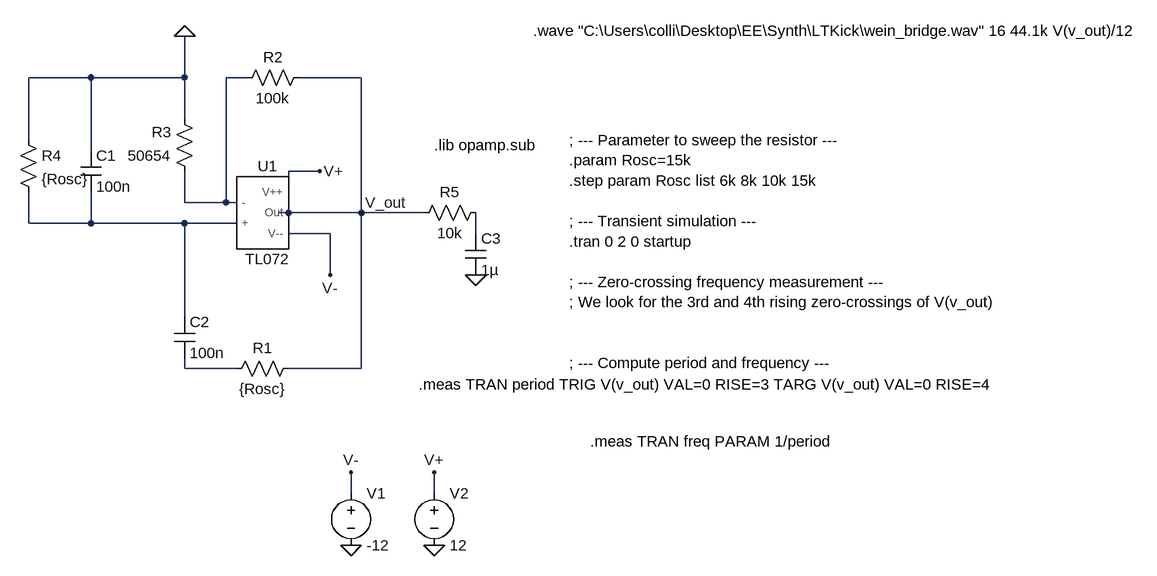
[diagram p0: schematic WeinBridgeV1.asc]
WeinBridgeV1.asc, the LTspice schematic file:
Version 4
SHEET 1 1672 728
WIRE -64 -64 -160 -64
WIRE 80 -64 80 -128
WIRE 80 -64 -64 -64
WIRE 176 -64 144 -64
WIRE 352 -64 256 -64
WIRE 80 0 80 -64
WIRE -160 32 -160 -64
WIRE -64 48 -64 -64
WIRE 288 80 240 80
WIRE 240 112 240 80
WIRE 80 128 80 80
WIRE 144 128 144 -64
WIRE 144 128 80 128
WIRE 160 128 144 128
WIRE 240 144 224 144
WIRE 352 144 352 -64
WIRE 352 144 240 144
WIRE 448 144 352 144
WIRE -160 160 -160 112
WIRE -64 160 -64 112
WIRE -64 160 -160 160
WIRE 80 160 -64 160
WIRE 160 160 80 160
WIRE 304 176 240 176
WIRE 528 176 528 144
WIRE 304 240 304 176
WIRE 80 304 80 160
WIRE 80 384 80 368
WIRE 160 384 80 384
WIRE 352 384 352 144
WIRE 352 384 240 384
WIRE 336 576 336 544
WIRE 464 576 464 544
FLAG 80 -128 0
FLAG 352 144 V_out
FLAG 336 656 0
FLAG 464 656 0
FLAG 464 544 V+
FLAG 336 544 V-
FLAG 288 80 V+
FLAG 304 240 V-
FLAG 528 240 0
SYMBOL res 256 368 R90
WINDOW 0 0 56 VBottom 2
WINDOW 3 32 56 VTop 2
SYMATTR InstName R1
SYMATTR Value {Rosc}
SYMBOL res 272 -80 R90
WINDOW 0 0 56 VBottom 2
WINDOW 3 32 56 VTop 2
SYMATTR InstName R2
SYMATTR Value 100k
SYMBOL res 96 96 R180
WINDOW 0 36 76 Left 2
WINDOW 3 36 40 Left 2
SYMATTR InstName R3
SYMATTR Value 50654
SYMBOL res -176 16 R0
SYMATTR InstName R4
SYMATTR Value {Rosc}
SYMBOL cap -80 48 R0
SYMATTR InstName C1
SYMATTR Value 100n
SYMBOL cap 64 304 R0
SYMATTR InstName C2
SYMATTR Value 100n
SYMBOL voltage 336 560 R0
WINDOW 123 0 0 Left 0
WINDOW 39 0 0 Left 0
SYMATTR InstName V1
SYMATTR Value -12
SYMBOL voltage 464 560 R0
WINDOW 123 0 0 Left 0
WINDOW 39 0 0 Left 0
SYMATTR InstName V2
SYMATTR Value 12
SYMBOL res 544 128 R90
WINDOW 0 0 56 VBottom 2
WINDOW 3 32 56 VTop 2
SYMATTR InstName R5
SYMATTR Value 10k
SYMBOL cap 512 176 R0
SYMATTR InstName C3
SYMATTR Value 1µ
SYMBOL TL072 208 144 R0
SYMATTR InstName U1
TEXT 464 40 Left 2 !.lib opamp.sub
TEXT 672 32 Left 2 !; --- Parameter to sweep the resistor ---\n.param Rosc=15k\n.step param Rosc list 6k 8k 10k 15k\n \n; --- Transient simulation ---\n.tran 0 2 0 startup\n \n; --- Zero-crossing frequency measurement ---\n; We look for the 3rd and 4th rising zero-crossings of V(v_out)\n \n \n; --- Compute period and frequency ---
TEXT 440 408 Left 2 !.meas TRAN period TRIG V(v_out) VAL=0 RISE=3 TARG V(v_out) VAL=0 RISE=4
TEXT 704 496 Left 2 !.meas TRAN freq PARAM 1/period
TEXT 616 -136 Left 2 !.wave "C:\\Users\\colli\\Desktop\\EE\\Synth\\LTKick\\wein_bridge.wav" 16 44.1k V(v_out)/12

The netlist it stands for:
* WeinBridgeV1.asc
R1 V_out N004 {Rosc}
R2 V_out N001 100k
R3 N001 0 50654
R4 0 N002 {Rosc}
C1 0 N002 100n
C2 N002 N004 100n
V1 V- 0 -12
V2 V+ 0 12
R5 N003 V_out 10k
C3 N003 0 1µ
XU1 N002 N001 V+ V- V_out TL072  ; pins + - V++ V-- Out
.lib opamp.sub
; --- Parameter to sweep the resistor ---
.param Rosc=15k
.step param Rosc list 6k 8k 10k 15k
; --- Transient simulation ---
.tran 0 2 0 startup
; --- Zero-crossing frequency measurement ---
; We look for the 3rd and 4th rising zero-crossings of V(v_out)
; --- Compute period and frequency ---
.meas TRAN period TRIG V(v_out) VAL=0 RISE=3 TARG V(v_out) VAL=0 RISE=4
.meas TRAN freq PARAM 1/period
.wave "C:\Users\colli\Desktop\EE\Synth\LTKick\wein_bridge.wav" 16 44.1k V(v_out)/12
.lib C:\Users\colli\Desktop\EE\Synth\LTKick\TL072.301
.backanno
.end